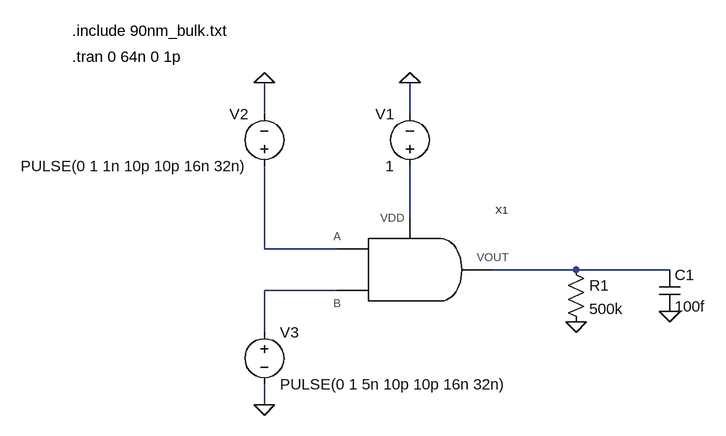
[diagram p0: schematic testerNOR.asc]
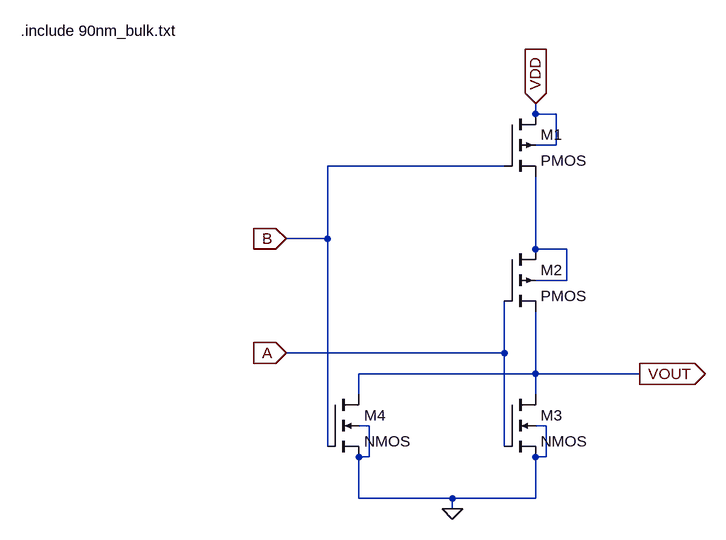
[diagram p1: sub-circuit nor.asc]
testerNOR.asc, the LTspice schematic file:
Version 4
SHEET 1 1152 680
WIRE 464 144 464 96
WIRE 688 144 688 96
WIRE 688 304 688 224
WIRE 464 352 464 224
WIRE 576 352 464 352
WIRE 944 384 816 384
WIRE 1088 384 944 384
WIRE 576 416 464 416
WIRE 464 480 464 416
WIRE 464 592 464 560
FLAG 464 592 0
FLAG 464 96 0
FLAG 688 96 0
FLAG 1088 448 0
FLAG 944 464 0
SYMBOL NOR 688 384 R0
SYMATTR InstName X1
SYMBOL voltage 688 240 R180
WINDOW 0 24 96 Left 2
WINDOW 3 24 16 Left 2
WINDOW 123 0 0 Left 0
WINDOW 39 0 0 Left 0
SYMATTR InstName V1
SYMATTR Value 1
SYMBOL voltage 464 464 R0
WINDOW 123 0 0 Left 0
WINDOW 39 0 0 Left 0
SYMATTR InstName V3
SYMATTR Value PULSE(0 1 5n 10p 10p 16n 32n)
SYMBOL voltage 464 240 R180
WINDOW 0 24 96 Left 2
WINDOW 3 24 16 Left 2
WINDOW 123 0 0 Left 0
WINDOW 39 0 0 Left 0
SYMATTR InstName V2
SYMATTR Value PULSE(0 1 1n 10p 10p 16n 32n)
SYMBOL cap 1072 384 R0
SYMATTR InstName C1
SYMATTR Value 100f
SYMBOL res 928 368 R0
SYMATTR InstName R1
SYMATTR Value 500k
TEXT 168 16 Left 2 !.include 90nm_bulk.txt
TEXT 168 56 Left 2 !.tran 0 64n 0 1p

nor.asc, the sub-circuit schematic file:
Version 4
SHEET 1 880 680
WIRE -11568 -3200 -11568 -3216
WIRE -11536 -3200 -11568 -3200
WIRE -11536 -3152 -11536 -3200
WIRE -11536 -3152 -11568 -3152
WIRE -11616 -3120 -11888 -3120
WIRE -11888 -3008 -11888 -3120
WIRE -11888 -3008 -11952 -3008
WIRE -11568 -2992 -11568 -3104
WIRE -11520 -2992 -11568 -2992
WIRE -11520 -2944 -11520 -2992
WIRE -11520 -2944 -11568 -2944
WIRE -11616 -2832 -11616 -2912
WIRE -11616 -2832 -11952 -2832
WIRE -11568 -2800 -11568 -2896
WIRE -11568 -2800 -11840 -2800
WIRE -11408 -2800 -11568 -2800
WIRE -11840 -2768 -11840 -2800
WIRE -11568 -2768 -11568 -2800
WIRE -11824 -2720 -11840 -2720
WIRE -11552 -2720 -11568 -2720
WIRE -11888 -2688 -11888 -3008
WIRE -11616 -2688 -11616 -2832
WIRE -11824 -2672 -11824 -2720
WIRE -11824 -2672 -11840 -2672
WIRE -11552 -2672 -11552 -2720
WIRE -11552 -2672 -11568 -2672
WIRE -11840 -2608 -11840 -2672
WIRE -11696 -2608 -11840 -2608
WIRE -11568 -2608 -11568 -2672
WIRE -11568 -2608 -11696 -2608
WIRE -11696 -2592 -11696 -2608
FLAG -11696 -2592 0
FLAG -11408 -2800 VOUT
IOPIN -11408 -2800 Out
FLAG -11952 -2832 A
IOPIN -11952 -2832 In
FLAG -11952 -3008 B
IOPIN -11952 -3008 In
FLAG -11568 -3216 VDD
IOPIN -11568 -3216 In
SYMBOL pmos4 -11616 -3200 R0
SYMATTR InstName M1
SYMATTR Value2 l=90n w=400n
SYMBOL pmos4 -11616 -2992 R0
SYMATTR InstName M2
SYMATTR Value2 l=90n w=400n
SYMBOL nmos4 -11616 -2768 R0
SYMATTR InstName M3
SYMATTR Value2 l=90n w=200n
SYMBOL nmos4 -11888 -2768 R0
SYMATTR InstName M4
SYMATTR Value2 l=90n w=200n
TEXT -12360 -3328 Left 2 !.include 90nm_bulk.txt

The netlist it stands for:
* testerNOR.asc
XX1 N002 N004 N001 N003 nor
V1 N001 0 1
V3 N004 0 PULSE(0 1 5n 10p 10p 16n 32n)
V2 N002 0 PULSE(0 1 1n 10p 10p 16n 32n)
C1 N003 0 100f
R1 N003 0 500k

* block symbol definitions
.subckt nor A B VDD VOUT
M1 VDD B N001 VDD PMOS l=90n w=400n
M2 N001 A VOUT N001 PMOS l=90n w=400n
M3 VOUT A 0 0 NMOS l=90n w=200n
M4 VOUT B 0 0 NMOS l=90n w=200n
.include 90nm_bulk.txt
.ends nor

.model NMOS NMOS
.model PMOS PMOS
.lib standard.mos
.include 90nm_bulk.txt
.tran 0 64n 0 1p
.backanno
.end